# Altium schematic sheet Recepteur.SchDoc
size A4
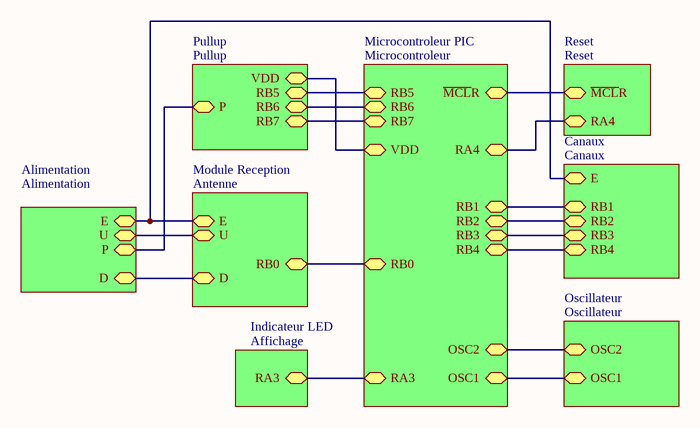
[diagram p0: Recepteur.SchDoc]

## Sub-sheets
Alimentation = Alimentation: E, U, D, P
Canaux = Canaux: RB1, RB2, RB3, RB4, E
Indicateur LED = Affichage: RA3
Microcontroleur PIC = Microcontroleur: RB5, RB6, RB7, RB0, RA3, OSC1, OSC2, RB4, RB3, RB2, RB1, ~{MCL}R, VDD, RA4
Module Reception = Antenne: RB0, D, U, E
Oscillateur = Oscillateur: OSC2, OSC1
Pullup = Pullup: RB5, RB6, RB7, P, VDD
Reset = Reset: ~{MCL}R, RA4

## Nets
(unnamed): sheet Canaux/RB1, sheet Microcontroleur PIC/RB1
(unnamed): sheet Canaux/RB2, sheet Microcontroleur PIC/RB2
(unnamed): sheet Canaux/RB3, sheet Microcontroleur PIC/RB3
(unnamed): sheet Canaux/RB4, sheet Microcontroleur PIC/RB4
(unnamed): sheet Canaux/E, sheet Alimentation/E, sheet Module Reception/E
(unnamed): sheet Reset/~{MCL}R, sheet Microcontroleur PIC/~{MCL}R
(unnamed): sheet Reset/RA4, sheet Microcontroleur PIC/RA4
(unnamed): sheet Oscillateur/OSC2, sheet Microcontroleur PIC/OSC2
(unnamed): sheet Oscillateur/OSC1, sheet Microcontroleur PIC/OSC1
(unnamed): sheet Alimentation/U, sheet Module Reception/U
(unnamed): sheet Alimentation/D, sheet Module Reception/D
(unnamed): sheet Alimentation/P, sheet Pullup/P
(unnamed): sheet Module Reception/RB0, sheet Microcontroleur PIC/RB0
(unnamed): sheet Indicateur LED/RA3, sheet Microcontroleur PIC/RA3
(unnamed): sheet Microcontroleur PIC/RB5, sheet Pullup/RB5
(unnamed): sheet Microcontroleur PIC/RB6, sheet Pullup/RB6
(unnamed): sheet Microcontroleur PIC/RB7, sheet Pullup/RB7
(unnamed): sheet Microcontroleur PIC/VDD, sheet Pullup/VDD